# EAGLE design dirtcheaprx_nano (EAGLE 6.4)
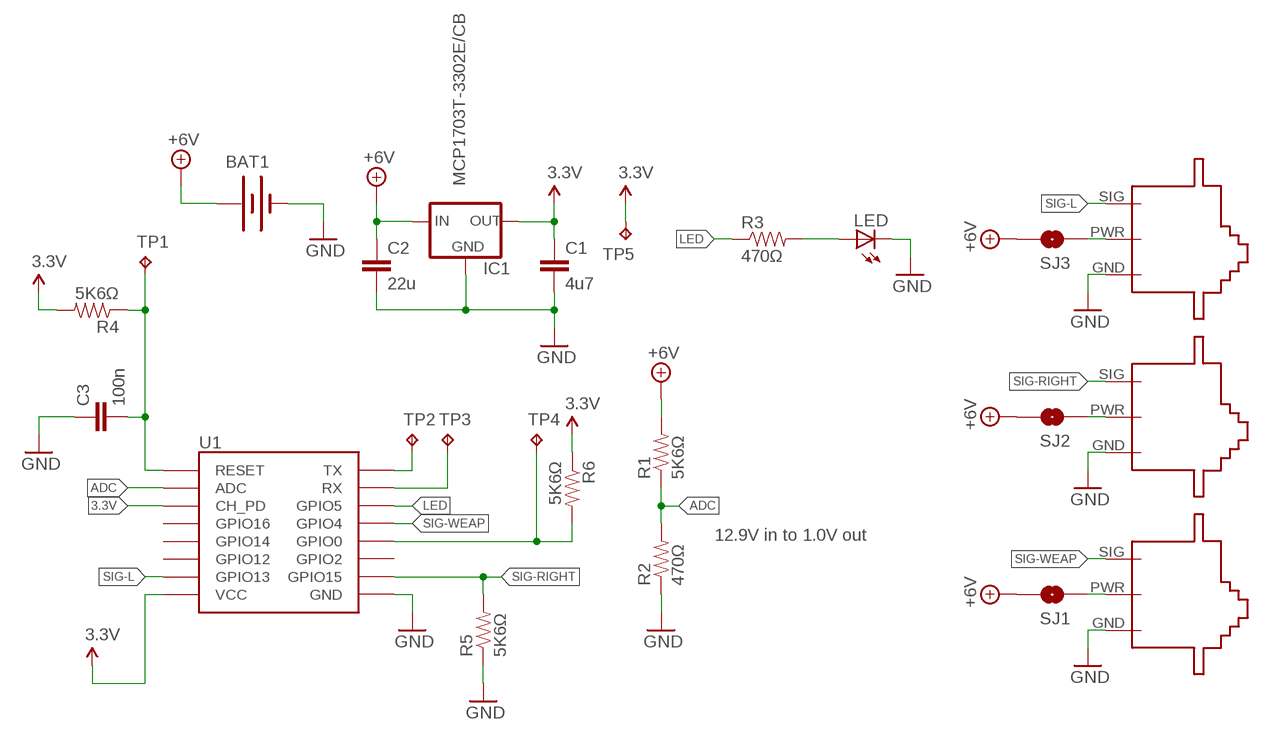
[diagram p0: schematic, sheet 1]

## Parts
BAT1  BATTERY-WIRE-CONN  [BATT-WIRE-CONN]
C1  4u7  CAP0805  [0805]
C2  22u  CAP0805  [0805]
C3  100n  CAP0603-CAP  [0603-CAP]
IC1  MCP1703T-3302E/CB  V_REG_78XX-SOT  [SOT23-3]
LED  LED5MM  [LED5MM]
R1  5K6Ω  RESISTOR0603-RES  [0603-RES]
R2  470Ω  RESISTOR0603-RES  [0603-RES]
R3  470Ω  RESISTOR0603-RES  [0603-RES]
R4  5K6Ω  RESISTOR0603-RES  [0603-RES]
R5  5K6Ω  RESISTOR0603-RES  [0603-RES]
R6  5K6Ω  RESISTOR0603-RES  [0603-RES]
SERVO1  SERVO-SMD-EDGE-1F  [SERVO-EDGE-F]
SERVO2  SERVO-SMD-EDGE-1  [SERVO-EDGE]
SERVO3  SERVO-SMD-EDGE-1  [SERVO-EDGE]
SJ1  SOLDERJUMPERNO  [SJ_2S-NO]
SJ2  SOLDERJUMPERNO  [SJ_2S-NO]
SJ3  SOLDERJUMPERNO  [SJ_2S-NO]
TP1  TPPAD1-13  [P1-13]
TP2  TPPAD1-13  [P1-13]
TP3  TPPAD1-13  [P1-13]
TP4  TPPAD1-13  [P1-13]
TP5  TPPAD1-13  [P1-13]
U1  ESP12SMD  [ESP12SE-SMD]

## Nets
3.3V: C1.1 IC1.2(OUT) R4.2 R6.1 TP5.TP U1.CH_PD U1.VCC
+6V: BAT1.POS(+) C2.1 IC1.3(IN) R1.2 SJ1.2 SJ2.2 SJ3.2
ADC: R1.1 R2.2 U1.ADC
GND: BAT1.NEG(-) C1.2 C2.2 C3.1 IC1.1(GND) LED.K(C) R2.1 R5.1 SERVO1.GND SERVO2.GND SERVO3.GND U1.GND
LED: R3.1 U1.GPIO5
N$1: LED.A R3.2
N$2: SERVO1.PWR SJ1.1
N$3: SERVO2.PWR SJ2.1
N$4: SERVO3.PWR SJ3.1
N$8: C3.2 R4.1 TP1.TP U1.RESET
N$9: TP2.TP U1.TXD0(TX)
N$10: TP3.TP U1.RXD0(RX)
N$11: R6.2 TP4.TP U1.GPIO0
SIG-L: SERVO3.SIG U1.GPIO13
SIG-RIGHT: R5.2 SERVO2.SIG U1.GPIO15
SIG-WEAP: SERVO1.SIG U1.GPIO4
Unconnected: U1.GPIO2 U1.GPIO12 U1.GPIO14 U1.GPIO16

## Notes on the sheet
- 12.9V in to 1.0V out

## Library data of the parts
BAT1 = dirtcheaprx_nano:BATTERY: Battery Holders Various common sizes : AA, AAA, 20mm coin cell and 12mm coin cell.
C1-C3 = dirtcheaprx_nano:CAP: Capacitor Standard 0603 ceramic capacitor, and 0.1" leaded capacitor.
IC1 = dirtcheaprx_nano:V_REG_78XX: Voltage Regulator Standard 7805 5V regulator. IGO (Input Ground Output). Spark Fun Electronics SKU : COM-00107
LED = dirtcheaprx_nano:LED: LEDs Standard schematic elements and footprints for 5mm, 3mm, 1206, and 0603 sized LEDs. 5mm - Spark Fun Electronics SKU : COM-00529 (and others)
R1-R6 = dirtcheaprx_nano:RESISTOR: Resistor Basic schematic elements and footprints for 0603, 1206, and PTH resistors.
SERVO1-SERVO3 = dirtcheaprx_nano:SERVO
SJ1-SJ3 = dirtcheaprx_nano:SOLDERJUMPER: Solder Jumper Standard SMD solder jumper. Used to automate production. Two varients : Normally Open and Normally Closed are the same, but have different paste layers. NC will have a large amount of paste and should jumper during reflow.
TP1-TP5 = dirtcheaprx_nano:TP: Test pad
U1 = dirtcheaprx_nano:ESP12: ESP8266 Wifi module 12

## Board
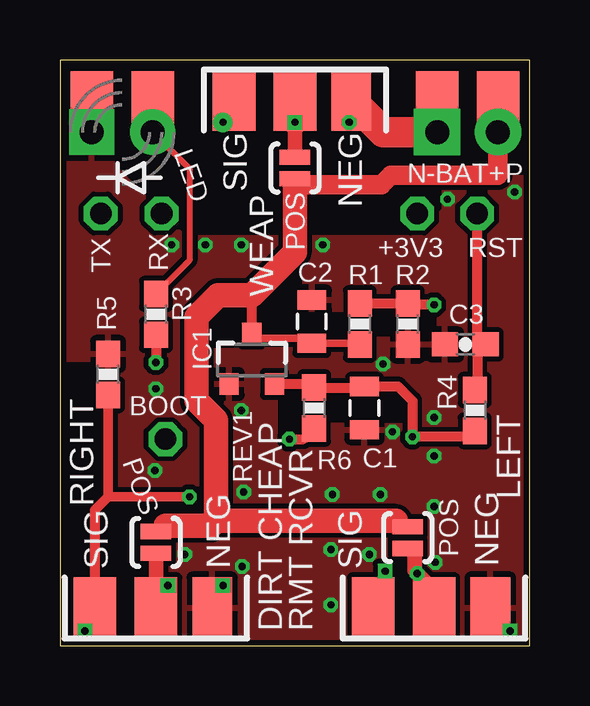
[diagram p1: board, top side]
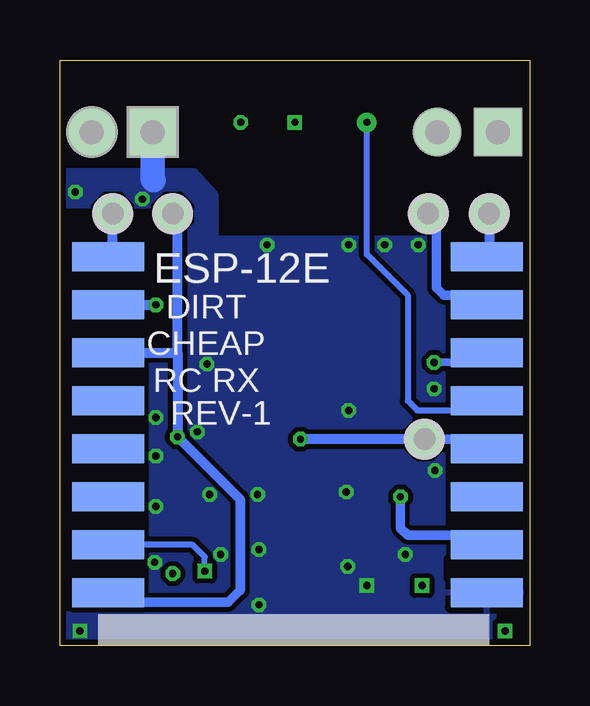
[diagram p2: board, bottom side, seen from below]

Size 19.6 x 24.4 mm. Coordinates in mm from the lower left corner, seen from the top.
Outline: 0,0 19.6,0 19.6,24.4 0,24.4 0,0
Copper layers (1*16): Top 0.035mm / dielectric 1.5mm / Bottom 0.035mm
Design rules "Fusion_eagle_rule_v1.1_TentedVias3": minimum track width 6mil, minimum drill 0.3mm, track to track 7mil, track to pad 7mil, pad to pad 7mil, via to via 7mil, smd to smd 0mil, copper to edge 10mil, drill to drill 10mil, minimum pad ring 10mil, minimum via ring 6mil, stop-mask expansion 2mil, vias tented up to drill 25mil, thermal gap 10mil
tRestrict: 13 lines
bRestrict: 4 lines

### Footprints (pad centres in the part's own frame; a part is rotated, then mirrored left to right if it is on the bottom)
BATT-WIRE-CONN = drill 1 pad 1.93 square: NEG 0,-1.27 | smd 2.54 x 1.778: P$1 -1.27,1.27; P$2 -1.27,-1.27 | drill 1 pad 1.93: POS 0,1.27
0805 = smd 0.8 x 1.2: 1 -0.9,0; 2 0.9,0
0603-CAP = smd 1.1 x 1: 1 -0.85,0; 2 0.85,0
SOT23-3 = smd 0.8 x 0.9: 1 -0.95,-1; 2 0.95,-1; 3 0,1.1
LED5MM = drill 1 pad 1.88: A -1.27,0 | drill 1 pad 1.88 square: K 1.27,0 | smd 1.778 x 2.54: P$1 -1.27,-1.27; P$2 1.27,-1.27
0603-RES = smd 1.1 x 1: 1 -0.85,0; 2 0.85,0
SERVO-EDGE-F = smd 1.651 x 2.54: GND -2.349,1.27 | smd 1.778 x 2.54: PWR 0,1.27; SIG 2.54,1.27
SERVO-EDGE = smd 1.651 x 2.54: GND 2.349,1.27 | smd 1.778 x 2.54: PWR 0,1.27; SIG -2.54,1.27
SJ_2S-NO = smd 0.635 x 1.27: 1 -0.45,0; 2 0.45,0
P1-13 = drill 0.9 octagon: TP 0,0
ESP12SE-SMD = smd 3 x 1.2: ADC -7.9,3.6; CH_PD -7.9,1.6; GND 7.9,-8.4; GPIO0 7.9,-2.4; GPIO2 7.9,-4.4; GPIO4 7.9,-0.4; GPIO5 7.9,1.6; GPIO12 -7.9,-4.4; GPIO13 -7.9,-6.4; GPIO14 -7.9,-2.4; GPIO15 7.9,-6.4; GPIO16 -7.9,-0.4; RESET -7.9,5.6; RXD0 7.9,3.6; TXD0 7.9,5.6; VCC -7.9,-8.4

### Placement (x,y rotation side)
BAT1  17,21.4 270 top
C1  12.7,9.9 270 top
C2  10.5,13.5 90 top
C3  16.9,12.55 0 top
IC1  8,11.9 0 top
LED  2.6,21.4 180 top
R1  12.5,13.4 270 top
R2  14.5,13.4 90 top
R3  4,13.8 90 top
R4  17.3,9.8 270 top
R5  2,11.3 270 top
R6  10.6,9.9 270 top
SERVO1  9.8,24 180 top
SERVO2  4,0.3 0 top
SERVO3  15.6,0.3 0 top
SJ1  9.8,19.9 270 top
SJ2  4,4.3 90 top
SJ3  14.5,4.5 90 top
TP1  17.4,18 0 bottom
TP2  1.7,18 0 bottom
TP3  4.24,18 0 bottom
TP4  4.4,8.6 0 bottom
TP5  14.9,18 0 bottom
U1  9.7,10.6 0 bottom

### Tracks (layer width: path | path; a pad name or v marks a point on that pad's centre or on a via)
3.3V  (via drill 0.3)
  Top 0.406: R4.2 17.35,8.7 v14.7,8.7 14.7,10.2 14.1,10.8 C1.1 12.7,10.75 R6.1 10.6,10.9 IC1.2
  Bottom 0.39: U1.VCC 17.7,1.8 12.6,1.8 12.1,2.3
  Bottom 0.406: U1.CH_PD 14.7,12.2 | 14.7,12.2 14.7,17.8 TP5.TP | 14.7,12.2 v14.7,8.7 12.1,6.1 12.1,2.3
+6V
  Top 0.254: SJ1.2 9.8,19.3 9.9,19.2
  Top 0.305: 8.2,12.8 10.2,12.8 C2.1 12.45,12.6 R1.2 12.45,12.5
  Top 0.406: 8,14.6 IC1.3 8.2,12.8
  Top 0.61: SJ3.2 14.05,5.05 14,5.2 | 4.4,5 4.35,5.1 SJ2.2
  Top 0.813: BAT1.POS 18.27,19.6 13.8,19.6 13.4,19.2 9.9,19.2 9.8,19.2
  Top 1.016: 14,5.2 6.5,5.2 | 6.5,5.2 6.3,5 4.4,5 | 9.8,19.2 9.8,16.4 8,14.6 6.6,14.6 5.7,13.7 5.7,10.2 6.5,9.4 6.5,5.2
ADC  (via drill 0.3)
  Top 0.406: v15.6,14.2 14.5,14.2 R2.2 R1.1
  Bottom 0.406: U1.ADC v15.6,14.2
GND  (via drill 0.3)
  Top 0.203: v12.06,21.8 12.15,21.89 SERVO1.GND
  Top 0.254: SERVO2.GND 6.35,2.05 v6.8,2.5
  Top 1.27: SERVO1.GND 13.48,21.4 BAT1.NEG
  Bottom 1.016: BAT1.NEG 15.73,19.43 15.7,19.4
  other vias: 18.77,0.61 7.6,3.3 13.47,11.73 7.56,16.7 4.66,16.7 6.06,16.7 7.56,9.8 10.96,16.7 15.65,3.47 15.6,5.8 11.3,1.7 12.9,3.8 15.6,9.5 15.6,7.9 7.66,6.4 13.36,6.3 18.96,18.9 16.16,18.6 5.2,3.8 3.96,7.3 11.36,6.3 13.87,8.91 11.3,4 4,10.7
  pour Top (isolate 0.203): 0,0 19.6,0 19.6,19.5 16,19.5 16,18.14 14.86,17 5.2,17 2.2,20 2.2,21.5 0,21.5
  pour Bottom (isolate 0.203): 0,0 19.6,0 19.6,19.8 14,19.8 13.1,18.8 13.1,17 0,17
LED  (via drill 0.3)
  Top 0.406: R3.1 v4,11.8
  Bottom 0.305: v4,11.8 2.3,11.8 U1.GPIO5
N$1
  Top 0.254: LED.A 5.4,19.87 5.4,16.05 R3.2
N$2  (via drill 0.3)
  Top 0.61: v9.8,21.8 SJ1.1
  Top 1.016: SERVO1.PWR v9.8,21.8
N$3  (via drill 0.3)
  Top 0.61: SJ2.1 SERVO2.PWR 4,2.2 v4.5,2.5
N$4  (via drill 0.3)
  Top 0.254: 14.6,3.9 14.6,3.1 14.7,3 v14.9,3
  Top 0.406: v14.9,3 14.9,4.05 SJ3.1
  Top 0.61: SERVO3.PWR 15.5,2.4 v14.9,3
N$8
  Top 0.406: TP1.TP 17.4,12.95 C3.2 17.4,12.2 17.4,10.65 R4.1
  Bottom 0.406: U1.RESET 17.4,16.2 TP1.TP
N$9
  Bottom 0.406: TP2.TP 1.7,16.4 U1.TXD0
N$10
  Bottom 0.39: TP3.TP 3.9,17.66 3.9,14.9 3.6,14.6 1.9,14.6 U1.RXD0
N$11  (via drill 0.3)
  Top 0.406: v9.57,8.6 10.15,8.6 R6.2
  Bottom 0.254: U1.GPIO0 2.3,8.6
  Bottom 0.39: 2.3,8.6 TP4.TP
  Bottom 0.406: TP4.TP v9.57,8.6
SIG-L  (via drill 0.3)
  Top 0.254: SERVO3.SIG v13.56,3.1
  Bottom 0.254: v13.56,3.1 13.56,3.7 14.06,4.2 U1.GPIO13
SIG-RIGHT  (via drill 0.3)
  Top 0.39: v5.4,6.2 2,6.2 R5.2 | v1.04,0.61 1.46,0.61 SERVO2.SIG
  Top 0.406: SERVO2.SIG 1.46,5.66 2,6.2
  Bottom 0.39: U1.GPIO15 2.3,4.6 5.1,4.6 5.4,4.9 v5.4,6.2
SIG-WEAP  (via drill 0.3 pad 0.81)
  Top 0.254: v6.8,21.8 6.8,22.27 SERVO1.SIG
  Bottom 0.254: U1.GPIO4 1.9,9.8 4.7,9.8 5.1,10.2 5.1,14.6 6.8,16.3 v6.8,21.8

### Text on the board
tPlace: SIG | NEG | N-BAT+P | WEAP | POS | REV1 | RIGHT | POS | LEFT | POS | SIG | NEG | SIG | NEG | DIRT CHEAP / RMT RCVR
bPlace: DIRT / CHEAP / RC RX | REV-1
tNames: TX | RX | +3V3 | RST | BOOT